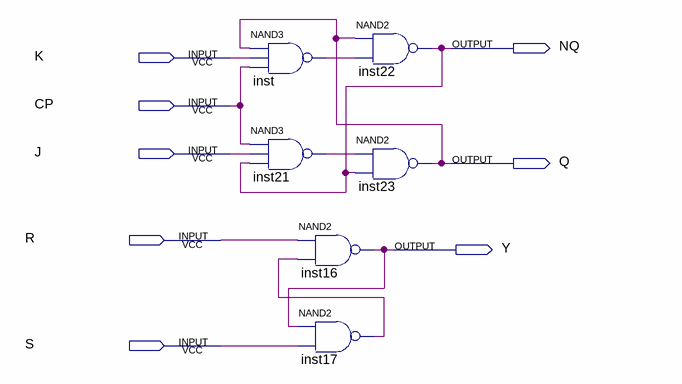
[diagram p0: schematic sheet]
// Quartus schematic jk.bdf as structural Verilog: 6 symbols, 8 pins
module jk (
  input  K,
  input  CP,
  input  J,
  input  R,
  input  S,
  output NQ,
  output Q,
  output Y
);

  wire inst17_out, inst21_out, inst_out;

  nand inst (inst_out, Q, K, CP);
  nand inst21 (inst21_out, CP, J, NQ);
  nand inst16 (Y, R, inst17_out);
  nand inst17 (inst17_out, Y, S);
  nand inst22 (NQ, Q, inst_out);
  nand inst23 (Q, inst21_out, NQ);
endmodule
